# Altium schematic sheet Power.SchDoc: Power
size 762 x 381 mm; DrawnBy: Soumil Jain
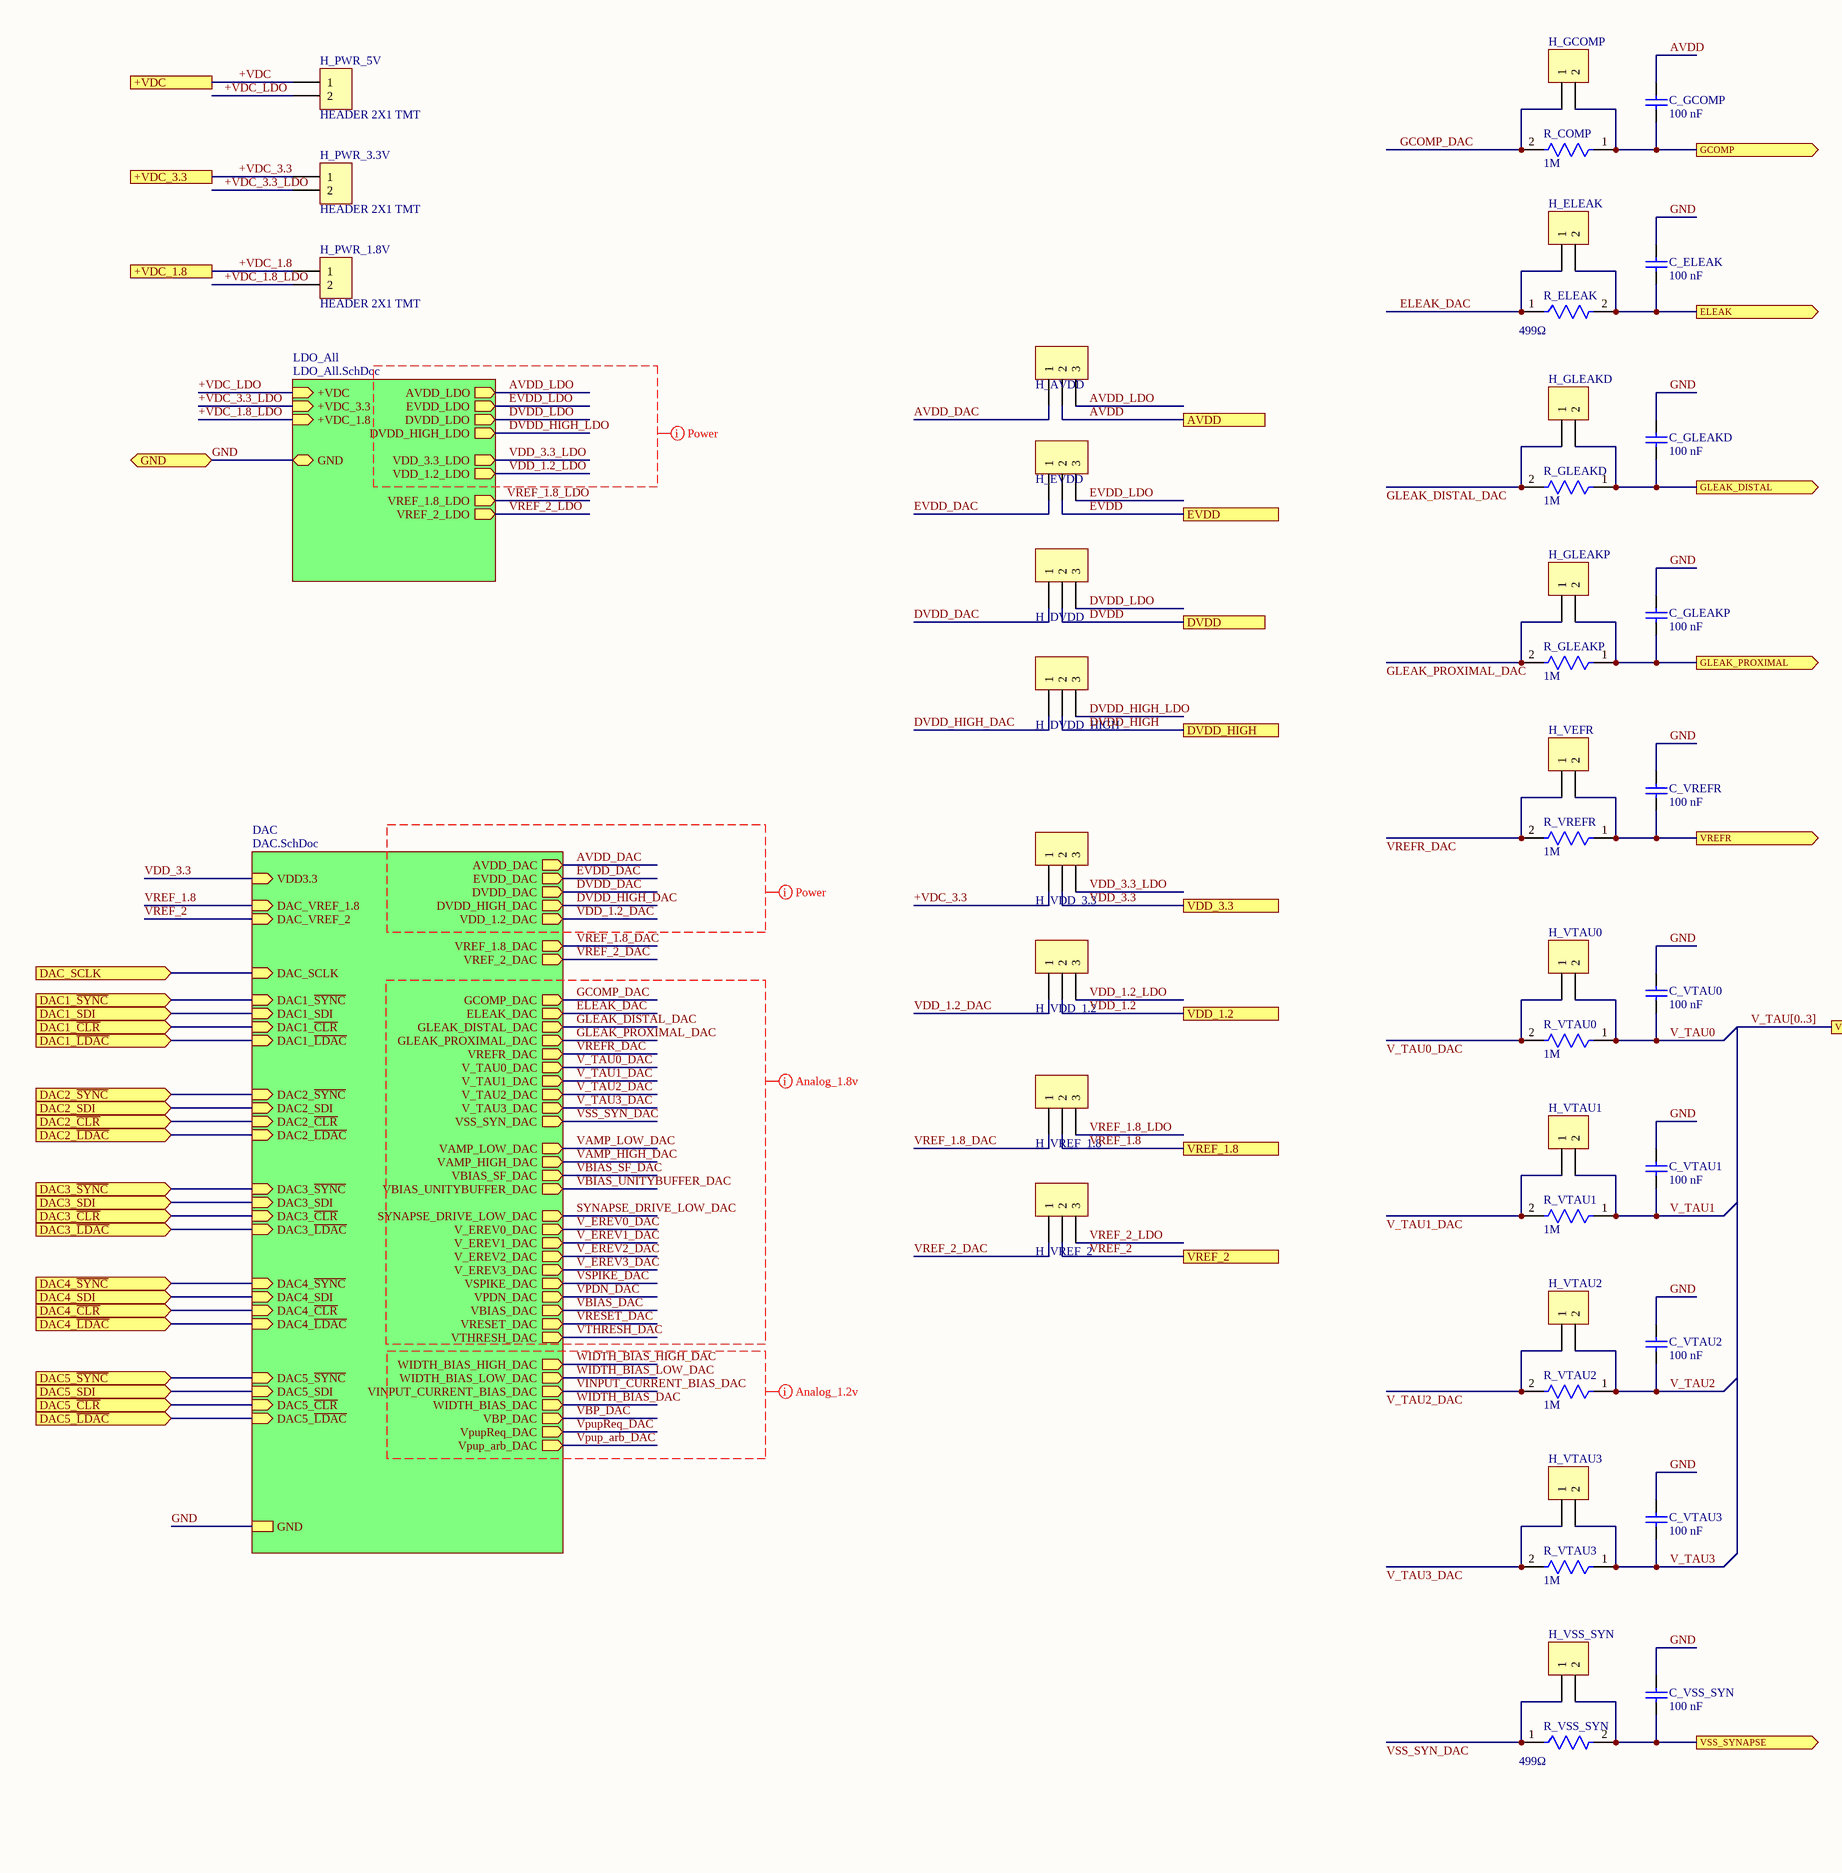
[diagram p0: Power.SchDoc, left]
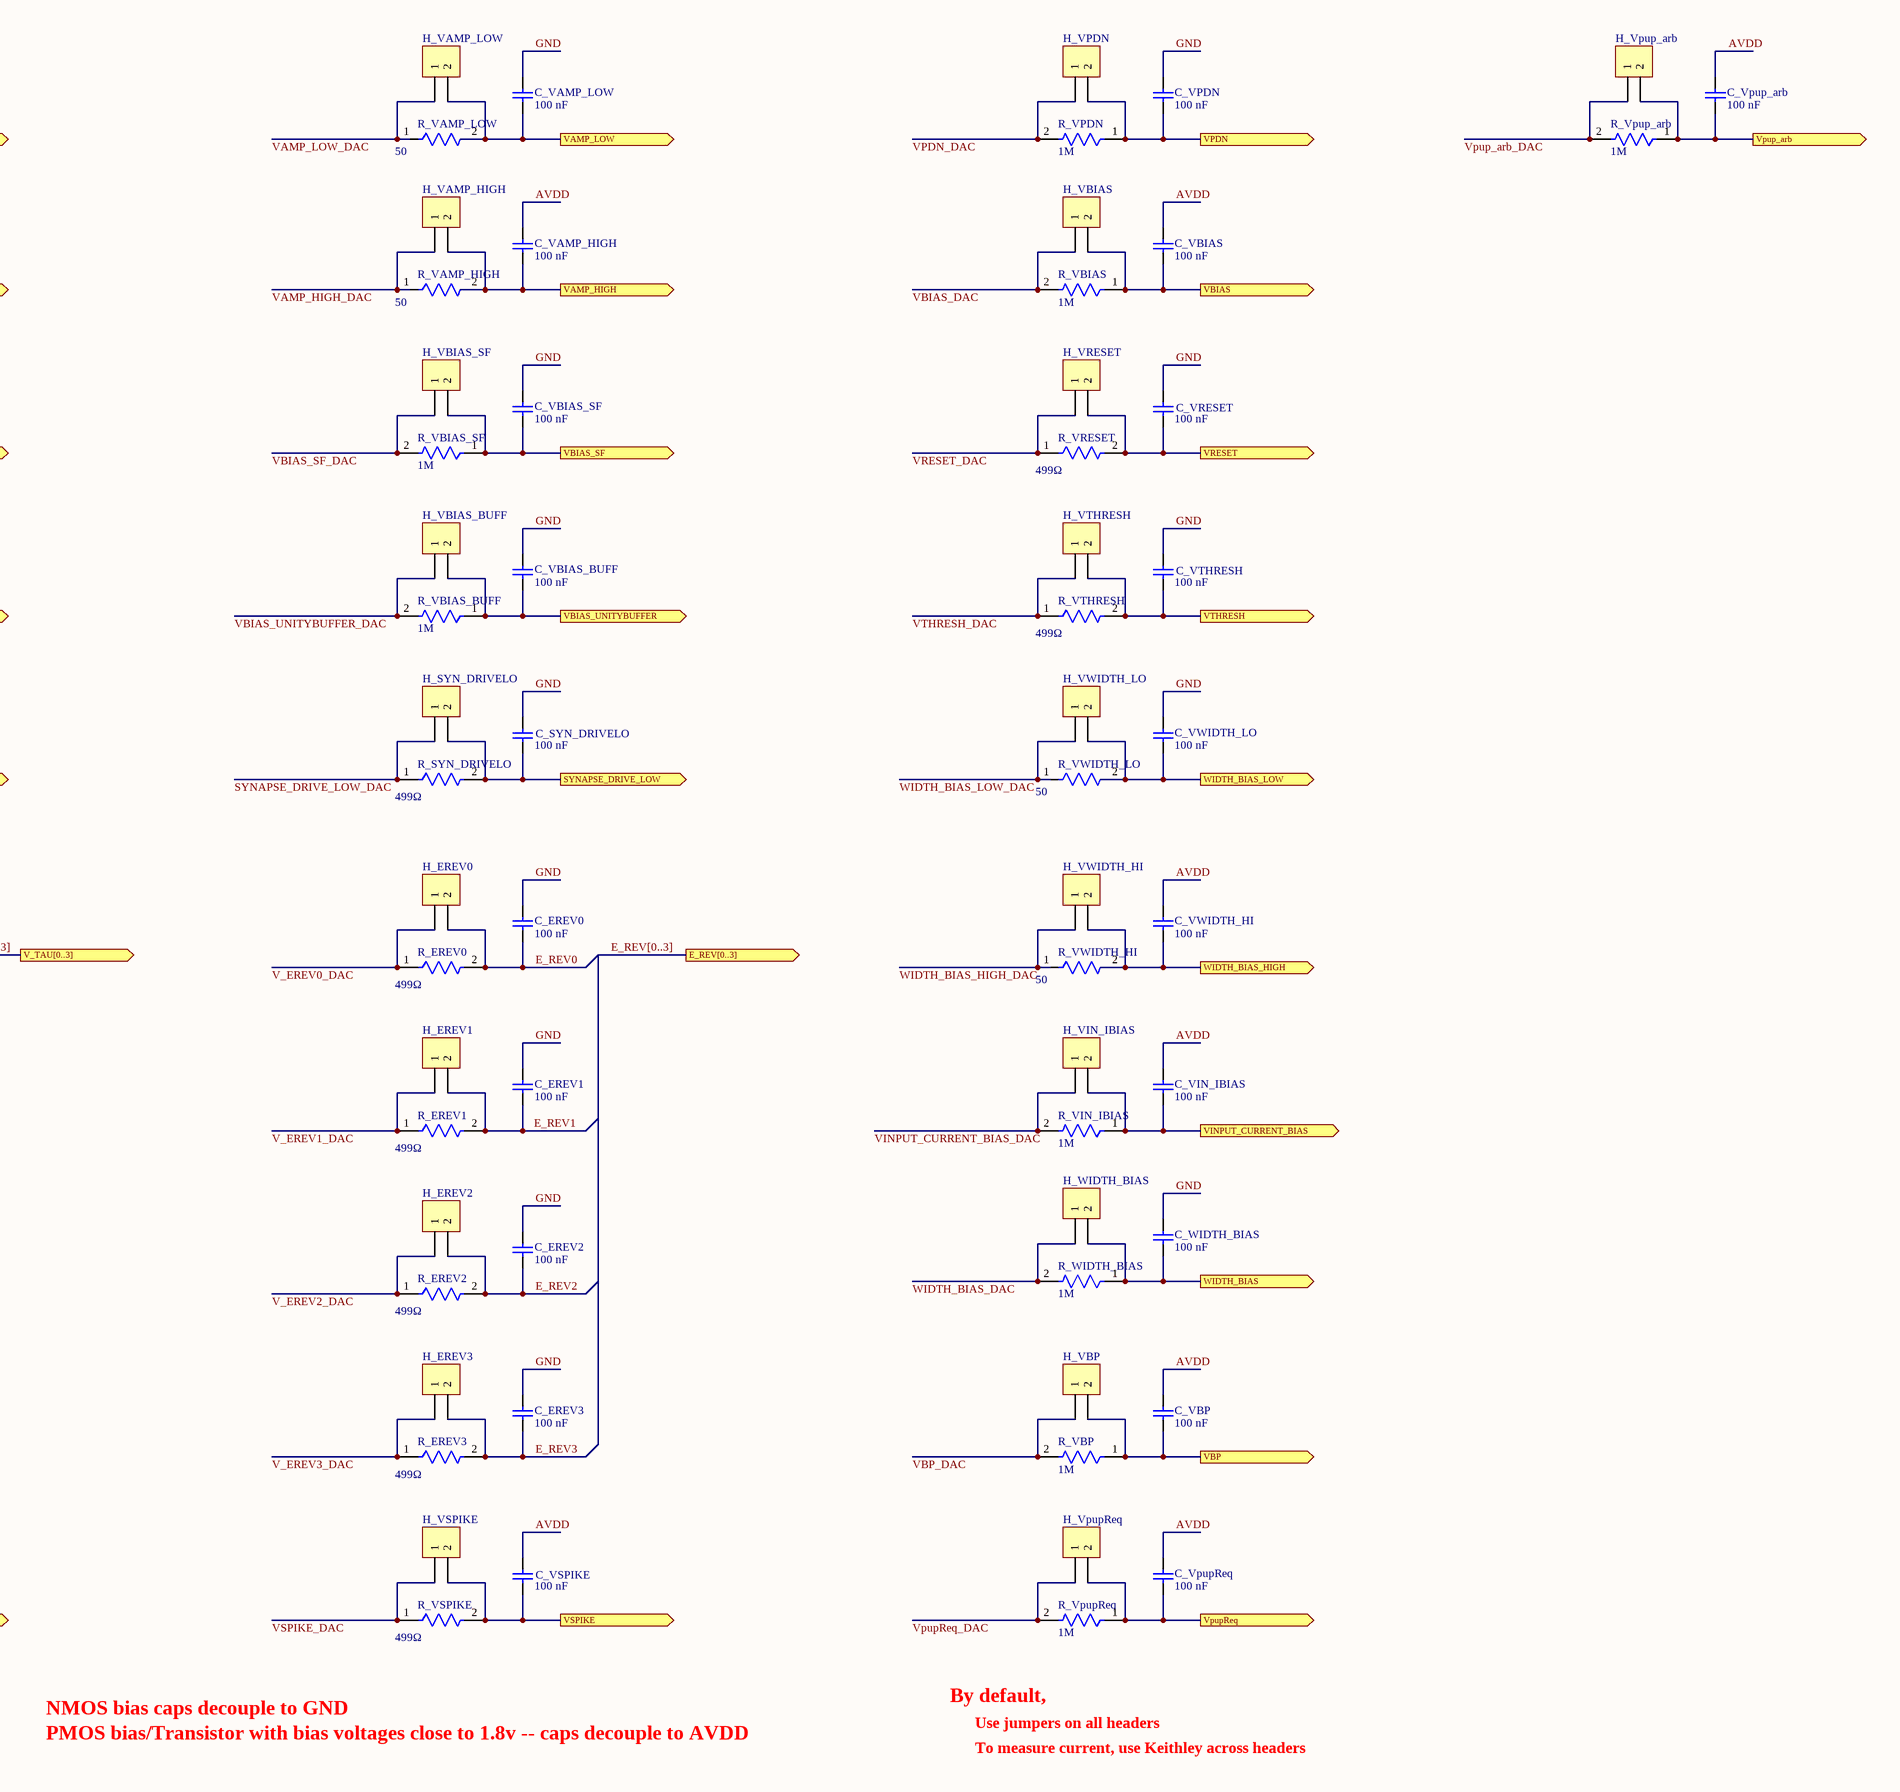
[diagram p1: Power.SchDoc, right]

## Parts
C_ELEAK  value 100 nF  [KEMET C0805C104J8RACTU]  (hidden comment: Cap 100nF 0805)
C_EREV0  value 100 nF  [KEMET C0805C104J8RACTU]  (hidden comment: Cap 100nF 0805)
C_EREV1  value 100 nF  [KEMET C0805C104J8RACTU]  (hidden comment: Cap 100nF 0805)
C_EREV2  value 100 nF  [KEMET C0805C104J8RACTU]  (hidden comment: Cap 100nF 0805)
C_EREV3  value 100 nF  [KEMET C0805C104J8RACTU]  (hidden comment: Cap 100nF 0805)
C_GCOMP  value 100 nF  [KEMET C0805C104J8RACTU]  (hidden comment: Cap 100nF 0805)
C_GLEAKD  value 100 nF  [KEMET C0805C104J8RACTU]  (hidden comment: Cap 100nF 0805)
C_GLEAKP  value 100 nF  [KEMET C0805C104J8RACTU]  (hidden comment: Cap 100nF 0805)
C_SYN_DRIVELO  value 100 nF  [KEMET C0805C104J8RACTU]  (hidden comment: Cap 100nF 0805)
C_VAMP_HIGH  value 100 nF  [KEMET C0805C104J8RACTU]  (hidden comment: Cap 100nF 0805)
C_VAMP_LOW  value 100 nF  [KEMET C0805C104J8RACTU]  (hidden comment: Cap 100nF 0805)
C_VBIAS  value 100 nF  [KEMET C0805C104J8RACTU]  (hidden comment: Cap 100nF 0805)
C_VBIAS_BUFF  value 100 nF  [KEMET C0805C104J8RACTU]  (hidden comment: Cap 100nF 0805)
C_VBIAS_SF  value 100 nF  [KEMET C0805C104J8RACTU]  (hidden comment: Cap 100nF 0805)
C_VBP  value 100 nF  [KEMET C0805C104J8RACTU]  (hidden comment: Cap 100nF 0805)
C_VIN_IBIAS  value 100 nF  [KEMET C0805C104J8RACTU]  (hidden comment: Cap 100nF 0805)
C_VPDN  value 100 nF  [KEMET C0805C104J8RACTU]  (hidden comment: Cap 100nF 0805)
C_Vpup_arb  value 100 nF  [KEMET C0805C104J8RACTU]  (hidden comment: Cap 100nF 0805)
C_VpupReq  value 100 nF  [KEMET C0805C104J8RACTU]  (hidden comment: Cap 100nF 0805)
C_VREFR  value 100 nF  [KEMET C0805C104J8RACTU]  (hidden comment: Cap 100nF 0805)
C_VRESET  value 100 nF  [KEMET C0805C104J8RACTU]  (hidden comment: Cap 100nF 0805)
C_VSPIKE  value 100 nF  [KEMET C0805C104J8RACTU]  (hidden comment: Cap 100nF 0805)
C_VSS_SYN  value 100 nF  [KEMET C0805C104J8RACTU]  (hidden comment: Cap 100nF 0805)
C_VTAU0  value 100 nF  [KEMET C0805C104J8RACTU]  (hidden comment: Cap 100nF 0805)
C_VTAU1  value 100 nF  [KEMET C0805C104J8RACTU]  (hidden comment: Cap 100nF 0805)
C_VTAU2  value 100 nF  [KEMET C0805C104J8RACTU]  (hidden comment: Cap 100nF 0805)
C_VTAU3  value 100 nF  [KEMET C0805C104J8RACTU]  (hidden comment: Cap 100nF 0805)
C_VTHRESH  value 100 nF  [KEMET C0805C104J8RACTU]  (hidden comment: Cap 100nF 0805)
C_VWIDTH_HI  value 100 nF  [KEMET C0805C104J8RACTU]  (hidden comment: Cap 100nF 0805)
C_VWIDTH_LO  value 100 nF  [KEMET C0805C104J8RACTU]  (hidden comment: Cap 100nF 0805)
C_WIDTH_BIAS  value 100 nF  [KEMET C0805C104J8RACTU]  (hidden comment: Cap 100nF 0805)
H_AVDD  HEADER 3X1 TMT  [Samtec TSW-103-07-L-S]  (value not drawn)
H_DVDD  HEADER 3X1 TMT  [Samtec TSW-103-07-L-S]  (value not drawn)
H_DVDD_HIGH  HEADER 3X1 TMT  [Samtec TSW-103-07-L-S]  (value not drawn)
H_ELEAK  HEADER 2X1 TMT  [Samtec TSW-102-07-G-S]  (value not drawn)
H_EREV0  HEADER 2X1 TMT  [Samtec TSW-102-07-G-S]  (value not drawn)
H_EREV1  HEADER 2X1 TMT  [Samtec TSW-102-07-G-S]  (value not drawn)
H_EREV2  HEADER 2X1 TMT  [Samtec TSW-102-07-G-S]  (value not drawn)
H_EREV3  HEADER 2X1 TMT  [Samtec TSW-102-07-G-S]  (value not drawn)
H_EVDD  HEADER 3X1 TMT  [Samtec TSW-103-07-L-S]  (value not drawn)
H_GCOMP  HEADER 2X1 TMT  [Samtec TSW-102-07-G-S]  (value not drawn)
H_GLEAKD  HEADER 2X1 TMT  [Samtec TSW-102-07-G-S]  (value not drawn)
H_GLEAKP  HEADER 2X1 TMT  [Samtec TSW-102-07-G-S]  (value not drawn)
H_PWR_1.8V  HEADER 2X1 TMT  [Samtec TSW-102-07-G-S]
H_PWR_3.3V  HEADER 2X1 TMT  [Samtec TSW-102-07-G-S]
H_PWR_5V  HEADER 2X1 TMT  [Samtec TSW-102-07-G-S]
H_SYN_DRIVELO  HEADER 2X1 TMT  [Samtec TSW-102-07-G-S]  (value not drawn)
H_VAMP_HIGH  HEADER 2X1 TMT  [Samtec TSW-102-07-G-S]  (value not drawn)
H_VAMP_LOW  HEADER 2X1 TMT  [Samtec TSW-102-07-G-S]  (value not drawn)
H_VBIAS  HEADER 2X1 TMT  [Samtec TSW-102-07-G-S]  (value not drawn)
H_VBIAS_BUFF  HEADER 2X1 TMT  [Samtec TSW-102-07-G-S]  (value not drawn)
H_VBIAS_SF  HEADER 2X1 TMT  [Samtec TSW-102-07-G-S]  (value not drawn)
H_VBP  HEADER 2X1 TMT  [Samtec TSW-102-07-G-S]  (value not drawn)
H_VDD_1.2  HEADER 3X1 TMT  [Samtec TSW-103-07-L-S]  (value not drawn)
H_VDD_3.3  HEADER 3X1 TMT  [Samtec TSW-103-07-L-S]  (value not drawn)
H_VEFR  HEADER 2X1 TMT  [Samtec TSW-102-07-G-S]  (value not drawn)
H_VIN_IBIAS  HEADER 2X1 TMT  [Samtec TSW-102-07-G-S]  (value not drawn)
H_VPDN  HEADER 2X1 TMT  [Samtec TSW-102-07-G-S]  (value not drawn)
H_Vpup_arb  HEADER 2X1 TMT  [Samtec TSW-102-07-G-S]  (value not drawn)
H_VpupReq  HEADER 2X1 TMT  [Samtec TSW-102-07-G-S]  (value not drawn)
H_VREF_1.8  HEADER 3X1 TMT  [Samtec TSW-103-07-L-S]  (value not drawn)
H_VREF_2  HEADER 3X1 TMT  [Samtec TSW-103-07-L-S]  (value not drawn)
H_VRESET  HEADER 2X1 TMT  [Samtec TSW-102-07-G-S]  (value not drawn)
H_VSPIKE  HEADER 2X1 TMT  [Samtec TSW-102-07-G-S]  (value not drawn)
H_VSS_SYN  HEADER 2X1 TMT  [Samtec TSW-102-07-G-S]  (value not drawn)
H_VTAU0  HEADER 2X1 TMT  [Samtec TSW-102-07-G-S]  (value not drawn)
H_VTAU1  HEADER 2X1 TMT  [Samtec TSW-102-07-G-S]  (value not drawn)
H_VTAU2  HEADER 2X1 TMT  [Samtec TSW-102-07-G-S]  (value not drawn)
H_VTAU3  HEADER 2X1 TMT  [Samtec TSW-102-07-G-S]  (value not drawn)
H_VTHRESH  HEADER 2X1 TMT  [Samtec TSW-102-07-G-S]  (value not drawn)
H_VWIDTH_HI  HEADER 2X1 TMT  [Samtec TSW-102-07-G-S]  (value not drawn)
H_VWIDTH_LO  HEADER 2X1 TMT  [Samtec TSW-102-07-G-S]  (value not drawn)
H_WIDTH_BIAS  HEADER 2X1 TMT  [Samtec TSW-102-07-G-S]  (value not drawn)
R_COMP  1M  [FP-CRCW0603-e3-MFG]
R_ELEAK  Resistance: 499Ω  [FP-RP73P-1J-MFG]  (hidden comment: RP73PF1J499RBTDF)
R_EREV0  Resistance: 499Ω  [FP-RP73P-1J-MFG]  (hidden comment: RP73PF1J499RBTDF)
R_EREV1  Resistance: 499Ω  [FP-RP73P-1J-MFG]  (hidden comment: RP73PF1J499RBTDF)
R_EREV2  Resistance: 499Ω  [FP-RP73P-1J-MFG]  (hidden comment: RP73PF1J499RBTDF)
R_EREV3  Resistance: 499Ω  [FP-RP73P-1J-MFG]  (hidden comment: RP73PF1J499RBTDF)
R_GLEAKD  1M  [FP-CRCW0603-e3-MFG]
R_GLEAKP  1M  [FP-CRCW0603-e3-MFG]
R_SYN_DRIVELO  Resistance: 499Ω  [FP-RP73P-1J-MFG]  (hidden comment: RP73PF1J499RBTDF)
R_VAMP_HIGH  RESISTANCE: 50  [FP-RN731E-IPC_A]  (hidden comment: RN731ETTP50R0F50)
R_VAMP_LOW  RESISTANCE: 50  [FP-RN731E-IPC_A]  (hidden comment: RN731ETTP50R0F50)
R_VBIAS  1M  [FP-CRCW0603-e3-MFG]
R_VBIAS_BUFF  1M  [FP-CRCW0603-e3-MFG]
R_VBIAS_SF  1M  [FP-CRCW0603-e3-MFG]
R_VBP  1M  [FP-CRCW0603-e3-MFG]
R_VIN_IBIAS  1M  [FP-CRCW0603-e3-MFG]
R_VPDN  1M  [FP-CRCW0603-e3-MFG]
R_Vpup_arb  1M  [FP-CRCW0603-e3-MFG]
R_VpupReq  1M  [FP-CRCW0603-e3-MFG]
R_VREFR  1M  [FP-CRCW0603-e3-MFG]
R_VRESET  Resistance: 499Ω  [FP-RP73P-1J-MFG]  (hidden comment: RP73PF1J499RBTDF)
R_VSPIKE  Resistance: 499Ω  [FP-RP73P-1J-MFG]  (hidden comment: RP73PF1J499RBTDF)
R_VSS_SYN  Resistance: 499Ω  [FP-RP73P-1J-MFG]  (hidden comment: RP73PF1J499RBTDF)
R_VTAU0  1M  [FP-CRCW0603-e3-MFG]
R_VTAU1  1M  [FP-CRCW0603-e3-MFG]
R_VTAU2  1M  [FP-CRCW0603-e3-MFG]
R_VTAU3  1M  [FP-CRCW0603-e3-MFG]
R_VTHRESH  Resistance: 499Ω  [FP-RP73P-1J-MFG]  (hidden comment: RP73PF1J499RBTDF)
R_VWIDTH_HI  RESISTANCE: 50  [FP-RN731E-IPC_A]  (hidden comment: RN731ETTP50R0F50)
R_VWIDTH_LO  RESISTANCE: 50  [FP-RN731E-IPC_A]  (hidden comment: RN731ETTP50R0F50)
R_WIDTH_BIAS  1M  [FP-CRCW0603-e3-MFG]

## Sub-sheets
DAC = DAC.SchDoc: DAC1_~{SYNC} (in), DAC_SCLK (in), DAC1_SDI (in), VDD3.3 (in), DAC_VREF_1.8 (in), EVDD_DAC (out), DAC1_~{CLR} (in), DAC1_~{LDAC} (in), GND, DAC2_~{SYNC} (in), DAC2_SDI (in), DAC2_~{CLR} (in), DAC2_~{LDAC} (in), AVDD_DAC (out), DVDD_DAC (out), DVDD_HIGH_DAC (out), VREF_1.8_DAC (out), GCOMP_DAC (out), ELEAK_DAC (out), GLEAK_DISTAL_DAC (out), GLEAK_PROXIMAL_DAC (out), VREFR_DAC (out), V_TAU0_DAC (out), V_TAU1_DAC (out), V_TAU2_DAC (out), V_TAU3_DAC (out), VSS_SYN_DAC (out), VAMP_LOW_DAC (out), VAMP_HIGH_DAC (out), VBIAS_SF_DAC (out), VBIAS_UNITYBUFFER_DAC (out), SYNAPSE_DRIVE_LOW_DAC (out), V_EREV0_DAC (out), V_EREV2_DAC (out), V_EREV1_DAC (out), V_EREV3_DAC (out), VSPIKE_DAC (out), VPDN_DAC (out), VBIAS_DAC (out), VRESET_DAC (out), VTHRESH_DAC (out), WIDTH_BIAS_HIGH_DAC (out), WIDTH_BIAS_LOW_DAC (out), VINPUT_CURRENT_BIAS_DAC (out), WIDTH_BIAS_DAC (out), VBP_DAC (out), VpupReq_DAC (out), Vpup_arb_DAC (out), DAC3_~{SYNC} (in), DAC3_SDI (in), DAC3_~{CLR} (in), DAC3_~{LDAC} (in), DAC_VREF_2 (in), VREF_2_DAC (out), DAC4_~{SYNC} (in), DAC4_SDI (in), DAC4_~{CLR} (in), DAC4_~{LDAC} (in), DAC5_~{LDAC} (in), DAC5_SDI (in), DAC5_~{SYNC} (in), DAC5_~{CLR} (in), VDD_1.2_DAC (out)
LDO_All = LDO_All.SchDoc: +VDC (in), GND (bidir), AVDD_LDO (out), DVDD_HIGH_LDO (out), EVDD_LDO (out), +VDC_3.3 (in), +VDC_1.8 (in), DVDD_LDO (out), VDD_3.3_LDO (out), VREF_1.8_LDO (out), VREF_2_LDO (out), VDD_1.2_LDO (out)

## Ports
+VDC, +VDC_1.8, +VDC_3.3, AVDD, DAC1_SDI (in), DAC1_~{CLR} (in), DAC1_~{LDAC} (in), DAC1_~{SYNC} (in), DAC2_SDI (in), DAC2_~{CLR} (in), DAC2_~{LDAC} (in), DAC2_~{SYNC} (in), DAC3_SDI (in), DAC3_~{CLR} (in), DAC3_~{LDAC} (in), DAC3_~{SYNC} (in), DAC4_SDI (in), DAC4_~{CLR} (in), DAC4_~{LDAC} (in), DAC4_~{SYNC} (in), DAC5_SDI (in), DAC5_~{CLR} (in), DAC5_~{LDAC} (in), DAC5_~{SYNC} (in), DAC_SCLK (in), DVDD, DVDD_HIGH, E_REV[0..3] (out), ELEAK (out), EVDD, GCOMP (out), GLEAK_DISTAL (out), GLEAK_PROXIMAL (out), GND (bidir), SYNAPSE_DRIVE_LOW (out), V_TAU[0..3] (out), VAMP_HIGH (out), VAMP_LOW (out), VBIAS (out), VBIAS_SF (out), VBIAS_UNITYBUFFER (out), VBP (out), VDD_1.2, VDD_3.3, VINPUT_CURRENT_BIAS (out), VPDN (out), Vpup_arb (out), VpupReq (out), VREF_1.8, VREF_2, VREFR (out), VRESET (out), VSPIKE (out), VSS_SYNAPSE (out), VTHRESH (out), WIDTH_BIAS (out), WIDTH_BIAS_HIGH (out), WIDTH_BIAS_LOW (out)

## Nets
+VDC: H_PWR_5V.1 ; port +VDC
+VDC_1.8: H_PWR_1.8V.1 ; port +VDC_1.8
+VDC_1.8_LDO: H_PWR_1.8V.2 ; sheet LDO_All/+VDC_1.8
+VDC_3.3: H_PWR_3.3V.1 H_VDD_3.3.1 ; port +VDC_3.3
+VDC_3.3_LDO: H_PWR_3.3V.2 ; sheet LDO_All/+VDC_3.3
+VDC_LDO: H_PWR_5V.2 ; sheet LDO_All/+VDC
AVDD: C_GCOMP.1 C_VAMP_HIGH.1 C_VBIAS.1 C_VBP.1 C_VIN_IBIAS.1 C_Vpup_arb.1 C_VpupReq.1 C_VSPIKE.1 C_VWIDTH_HI.1 H_AVDD.2 ; port AVDD
AVDD_DAC: H_AVDD.1 ; sheet DAC/AVDD_DAC
AVDD_LDO: H_AVDD.3 ; sheet LDO_All/AVDD_LDO
DAC1_~{CLR}: port DAC1_~{CLR}, sheet DAC/DAC1_~{CLR}
DAC1_~{LDAC}: port DAC1_~{LDAC}, sheet DAC/DAC1_~{LDAC}
DAC1_~{SYNC}: port DAC1_~{SYNC}, sheet DAC/DAC1_~{SYNC}
DAC1_SDI: port DAC1_SDI, sheet DAC/DAC1_SDI
DAC2_~{CLR}: port DAC2_~{CLR}, sheet DAC/DAC2_~{CLR}
DAC2_~{LDAC}: port DAC2_~{LDAC}, sheet DAC/DAC2_~{LDAC}
DAC2_~{SYNC}: port DAC2_~{SYNC}, sheet DAC/DAC2_~{SYNC}
DAC2_SDI: port DAC2_SDI, sheet DAC/DAC2_SDI
DAC3_~{CLR}: port DAC3_~{CLR}, sheet DAC/DAC3_~{CLR}
DAC3_~{LDAC}: port DAC3_~{LDAC}, sheet DAC/DAC3_~{LDAC}
DAC3_~{SYNC}: port DAC3_~{SYNC}, sheet DAC/DAC3_~{SYNC}
DAC3_SDI: port DAC3_SDI, sheet DAC/DAC3_SDI
DAC4_~{CLR}: port DAC4_~{CLR}, sheet DAC/DAC4_~{CLR}
DAC4_~{LDAC}: port DAC4_~{LDAC}, sheet DAC/DAC4_~{LDAC}
DAC4_~{SYNC}: port DAC4_~{SYNC}, sheet DAC/DAC4_~{SYNC}
DAC4_SDI: port DAC4_SDI, sheet DAC/DAC4_SDI
DAC5_~{CLR}: port DAC5_~{CLR}, sheet DAC/DAC5_~{CLR}
DAC5_~{LDAC}: port DAC5_~{LDAC}, sheet DAC/DAC5_~{LDAC}
DAC5_~{SYNC}: port DAC5_~{SYNC}, sheet DAC/DAC5_~{SYNC}
DAC5_SDI: port DAC5_SDI, sheet DAC/DAC5_SDI
DAC_SCLK: port DAC_SCLK, sheet DAC/DAC_SCLK
DVDD: H_DVDD.2 ; port DVDD
DVDD_DAC: H_DVDD.1 ; sheet DAC/DVDD_DAC
DVDD_HIGH: H_DVDD_HIGH.2 ; port DVDD_HIGH
DVDD_HIGH_DAC: H_DVDD_HIGH.1 ; sheet DAC/DVDD_HIGH_DAC
DVDD_HIGH_LDO: H_DVDD_HIGH.3 ; sheet LDO_All/DVDD_HIGH_LDO
DVDD_LDO: H_DVDD.3 ; sheet LDO_All/DVDD_LDO
E_REV0: C_EREV0.2 H_EREV0.2 R_EREV0.2
E_REV1: C_EREV1.2 H_EREV1.2 R_EREV1.2
E_REV2: C_EREV2.2 H_EREV2.2 R_EREV2.2
E_REV3: C_EREV3.2 H_EREV3.2 R_EREV3.2
ELEAK: C_ELEAK.2 H_ELEAK.2 R_ELEAK.2 ; port ELEAK
ELEAK_DAC: H_ELEAK.1 R_ELEAK.1 ; sheet DAC/ELEAK_DAC
EVDD: H_EVDD.2 ; port EVDD
EVDD_DAC: H_EVDD.1 ; sheet DAC/EVDD_DAC
EVDD_LDO: H_EVDD.3 ; sheet LDO_All/EVDD_LDO
GCOMP: C_GCOMP.2 H_GCOMP.2 R_COMP.1 ; port GCOMP
GCOMP_DAC: H_GCOMP.1 R_COMP.2 ; sheet DAC/GCOMP_DAC
GLEAK_DISTAL: C_GLEAKD.2 H_GLEAKD.2 R_GLEAKD.1 ; port GLEAK_DISTAL
GLEAK_DISTAL_DAC: H_GLEAKD.1 R_GLEAKD.2 ; sheet DAC/GLEAK_DISTAL_DAC
GLEAK_PROXIMAL: C_GLEAKP.2 H_GLEAKP.2 R_GLEAKP.1 ; port GLEAK_PROXIMAL
GLEAK_PROXIMAL_DAC: H_GLEAKP.1 R_GLEAKP.2 ; sheet DAC/GLEAK_PROXIMAL_DAC
GND: C_ELEAK.1 C_EREV0.1 C_EREV1.1 C_EREV2.1 C_EREV3.1 C_GLEAKD.1 C_GLEAKP.1 C_SYN_DRIVELO.1 C_VAMP_LOW.1 C_VBIAS_BUFF.1 C_VBIAS_SF.1 C_VPDN.1 C_VREFR.1 C_VRESET.1 C_VSS_SYN.1 C_VTAU0.1 C_VTAU1.1 C_VTAU2.1 C_VTAU3.1 C_VTHRESH.1 C_VWIDTH_LO.1 C_WIDTH_BIAS.1 ; port GND, sheet LDO_All/GND, sheet DAC/GND
SYNAPSE_DRIVE_LOW: C_SYN_DRIVELO.2 H_SYN_DRIVELO.2 R_SYN_DRIVELO.2 ; port SYNAPSE_DRIVE_LOW
SYNAPSE_DRIVE_LOW_DAC: H_SYN_DRIVELO.1 R_SYN_DRIVELO.1 ; sheet DAC/SYNAPSE_DRIVE_LOW_DAC
V_EREV0_DAC: H_EREV0.1 R_EREV0.1 ; sheet DAC/V_EREV0_DAC
V_EREV1_DAC: H_EREV1.1 R_EREV1.1 ; sheet DAC/V_EREV1_DAC
V_EREV2_DAC: H_EREV2.1 R_EREV2.1 ; sheet DAC/V_EREV2_DAC
V_EREV3_DAC: H_EREV3.1 R_EREV3.1 ; sheet DAC/V_EREV3_DAC
V_TAU0: C_VTAU0.2 H_VTAU0.2 R_VTAU0.1
V_TAU0_DAC: H_VTAU0.1 R_VTAU0.2 ; sheet DAC/V_TAU0_DAC
V_TAU1: C_VTAU1.2 H_VTAU1.2 R_VTAU1.1
V_TAU1_DAC: H_VTAU1.1 R_VTAU1.2 ; sheet DAC/V_TAU1_DAC
V_TAU2: C_VTAU2.2 H_VTAU2.2 R_VTAU2.1
V_TAU2_DAC: H_VTAU2.1 R_VTAU2.2 ; sheet DAC/V_TAU2_DAC
V_TAU3: C_VTAU3.2 H_VTAU3.2 R_VTAU3.1
V_TAU3_DAC: H_VTAU3.1 R_VTAU3.2 ; sheet DAC/V_TAU3_DAC
VAMP_HIGH: C_VAMP_HIGH.2 H_VAMP_HIGH.2 R_VAMP_HIGH.2 ; port VAMP_HIGH
VAMP_HIGH_DAC: H_VAMP_HIGH.1 R_VAMP_HIGH.1 ; sheet DAC/VAMP_HIGH_DAC
VAMP_LOW: C_VAMP_LOW.2 H_VAMP_LOW.2 R_VAMP_LOW.2 ; port VAMP_LOW
VAMP_LOW_DAC: H_VAMP_LOW.1 R_VAMP_LOW.1 ; sheet DAC/VAMP_LOW_DAC
VBIAS: C_VBIAS.2 H_VBIAS.2 R_VBIAS.1 ; port VBIAS
VBIAS_DAC: H_VBIAS.1 R_VBIAS.2 ; sheet DAC/VBIAS_DAC
VBIAS_SF: C_VBIAS_SF.2 H_VBIAS_SF.2 R_VBIAS_SF.1 ; port VBIAS_SF
VBIAS_SF_DAC: H_VBIAS_SF.1 R_VBIAS_SF.2 ; sheet DAC/VBIAS_SF_DAC
VBIAS_UNITYBUFFER: C_VBIAS_BUFF.2 H_VBIAS_BUFF.2 R_VBIAS_BUFF.1 ; port VBIAS_UNITYBUFFER
VBIAS_UNITYBUFFER_DAC: H_VBIAS_BUFF.1 R_VBIAS_BUFF.2 ; sheet DAC/VBIAS_UNITYBUFFER_DAC
VBP: C_VBP.2 H_VBP.2 R_VBP.1 ; port VBP
VBP_DAC: H_VBP.1 R_VBP.2 ; sheet DAC/VBP_DAC
VDD_1.2: H_VDD_1.2.2 ; port VDD_1.2
VDD_1.2_DAC: H_VDD_1.2.1 ; sheet DAC/VDD_1.2_DAC
VDD_1.2_LDO: H_VDD_1.2.3 ; sheet LDO_All/VDD_1.2_LDO
VDD_3.3: H_VDD_3.3.2 ; port VDD_3.3, sheet DAC/VDD3.3
VDD_3.3_LDO: H_VDD_3.3.3 ; sheet LDO_All/VDD_3.3_LDO
VINPUT_CURRENT_BIAS: C_VIN_IBIAS.2 H_VIN_IBIAS.2 R_VIN_IBIAS.1 ; port VINPUT_CURRENT_BIAS
VINPUT_CURRENT_BIAS_DAC: H_VIN_IBIAS.1 R_VIN_IBIAS.2 ; sheet DAC/VINPUT_CURRENT_BIAS_DAC
VPDN: C_VPDN.2 H_VPDN.2 R_VPDN.1 ; port VPDN
VPDN_DAC: H_VPDN.1 R_VPDN.2 ; sheet DAC/VPDN_DAC
Vpup_arb: C_Vpup_arb.2 H_Vpup_arb.2 R_Vpup_arb.1 ; port Vpup_arb
Vpup_arb_DAC: H_Vpup_arb.1 R_Vpup_arb.2 ; sheet DAC/Vpup_arb_DAC
VpupReq: C_VpupReq.2 H_VpupReq.2 R_VpupReq.1 ; port VpupReq
VpupReq_DAC: H_VpupReq.1 R_VpupReq.2 ; sheet DAC/VpupReq_DAC
VREF_1.8: H_VREF_1.8.2 ; port VREF_1.8, sheet DAC/DAC_VREF_1.8
VREF_1.8_DAC: H_VREF_1.8.1 ; sheet DAC/VREF_1.8_DAC
VREF_1.8_LDO: H_VREF_1.8.3 ; sheet LDO_All/VREF_1.8_LDO
VREF_2: H_VREF_2.2 ; port VREF_2, sheet DAC/DAC_VREF_2
VREF_2_DAC: H_VREF_2.1 ; sheet DAC/VREF_2_DAC
VREF_2_LDO: H_VREF_2.3 ; sheet LDO_All/VREF_2_LDO
VREFR: C_VREFR.2 H_VEFR.2 R_VREFR.1 ; port VREFR
VREFR_DAC: H_VEFR.1 R_VREFR.2 ; sheet DAC/VREFR_DAC
VRESET: C_VRESET.2 H_VRESET.2 R_VRESET.2 ; port VRESET
VRESET_DAC: H_VRESET.1 R_VRESET.1 ; sheet DAC/VRESET_DAC
VSPIKE: C_VSPIKE.2 H_VSPIKE.2 R_VSPIKE.2 ; port VSPIKE
VSPIKE_DAC: H_VSPIKE.1 R_VSPIKE.1 ; sheet DAC/VSPIKE_DAC
VSS_SYN_DAC: H_VSS_SYN.1 R_VSS_SYN.1 ; sheet DAC/VSS_SYN_DAC
VSS_SYNAPSE: C_VSS_SYN.2 H_VSS_SYN.2 R_VSS_SYN.2 ; port VSS_SYNAPSE
VTHRESH: C_VTHRESH.2 H_VTHRESH.2 R_VTHRESH.2 ; port VTHRESH
VTHRESH_DAC: H_VTHRESH.1 R_VTHRESH.1 ; sheet DAC/VTHRESH_DAC
WIDTH_BIAS: C_WIDTH_BIAS.2 H_WIDTH_BIAS.2 R_WIDTH_BIAS.1 ; port WIDTH_BIAS
WIDTH_BIAS_DAC: H_WIDTH_BIAS.1 R_WIDTH_BIAS.2 ; sheet DAC/WIDTH_BIAS_DAC
WIDTH_BIAS_HIGH: C_VWIDTH_HI.2 H_VWIDTH_HI.2 R_VWIDTH_HI.2 ; port WIDTH_BIAS_HIGH
WIDTH_BIAS_HIGH_DAC: H_VWIDTH_HI.1 R_VWIDTH_HI.1 ; sheet DAC/WIDTH_BIAS_HIGH_DAC
WIDTH_BIAS_LOW: C_VWIDTH_LO.2 H_VWIDTH_LO.2 R_VWIDTH_LO.2 ; port WIDTH_BIAS_LOW
WIDTH_BIAS_LOW_DAC: H_VWIDTH_LO.1 R_VWIDTH_LO.1 ; sheet DAC/WIDTH_BIAS_LOW_DAC

## Buses and harness runs
bus E_REV[0..3] = port E_REV[0..3]
bus V_TAU[0..3] = port V_TAU[0..3]

## Layout directives
mark named Power: AVDD_DAC, AVDD_LDO, DVDD_DAC, DVDD_HIGH_DAC, DVDD_HIGH_LDO, DVDD_LDO, EVDD_DAC, EVDD_LDO, VDD_1.2_DAC, VDD_1.2_LDO, VDD_3.3_LDO
mark named Analog_1.8v: ELEAK_DAC, GCOMP_DAC, GLEAK_DISTAL_DAC, GLEAK_PROXIMAL_DAC, SYNAPSE_DRIVE_LOW_DAC, V_EREV0_DAC, V_EREV1_DAC, V_EREV2_DAC, V_EREV3_DAC, V_TAU0_DAC, V_TAU1_DAC, V_TAU2_DAC, V_TAU3_DAC, VAMP_HIGH_DAC, VAMP_LOW_DAC, VBIAS_DAC, VBIAS_SF_DAC, VBIAS_UNITYBUFFER_DAC, VPDN_DAC, VREFR_DAC, VRESET_DAC, VSPIKE_DAC, VSS_SYN_DAC, VTHRESH_DAC
mark named Analog_1.2v: VBP_DAC, VINPUT_CURRENT_BIAS_DAC, Vpup_arb_DAC, VpupReq_DAC, WIDTH_BIAS_DAC, WIDTH_BIAS_HIGH_DAC, WIDTH_BIAS_LOW_DAC

## Notes on the sheet
- NMOS bias caps decouple to GND
- PMOS bias/Transistor with bias voltages close to 1.8v -- caps decouple to AVDD
- By default,
- Use jumpers on all headers
- To measure current, use Keithley across headers

## Library data of the parts
C_ELEAK C_EREV0-C_EREV3 C_GCOMP C_GLEAKD C_GLEAKP C_SYN_DRIVELO C_VAMP_HIGH C_VAMP_LOW C_VBIAS C_VBIAS_BUFF C_VBIAS_SF C_VBP C_VIN_IBIAS C_VPDN C_Vpup_arb C_VpupReq C_VREFR C_VRESET C_VSPIKE C_VSS_SYN C_VTAU0-C_VTAU3 C_VTHRESH C_VWIDTH_HI C_VWIDTH_LO C_WIDTH_BIAS = Cap 100nF 0805: CAP CER 0.1UF 10V X7R 0805 / ±10% 10V Ceramic Capacitor X7R 0805 (2012 Metric); Supplier 1: Digi-Key; Supplier Part Number 1: 478-5311-1-ND
H_AVDD H_DVDD H_DVDD_HIGH H_EVDD H_VDD_1.2 H_VDD_3.3 H_VREF_1.8 H_VREF_2 = HEADER 3X1 TMT: CONN HEADER VERT 3POS 2.54MM / Connector Header Through Hole 3 position 0.100" (2.54mm); Supplier 1: Digi-Key; Supplier Part Number 1: SAM1031-03-ND
H_ELEAK H_EREV0-H_EREV3 H_GCOMP H_GLEAKD H_GLEAKP H_PWR_1.8V H_PWR_3.3V H_PWR_5V H_SYN_DRIVELO H_VAMP_HIGH H_VAMP_LOW H_VBIAS H_VBIAS_BUFF H_VBIAS_SF H_VBP H_VEFR H_VIN_IBIAS H_VPDN H_Vpup_arb H_VpupReq H_VRESET H_VSPIKE H_VSS_SYN H_VTAU0-H_VTAU3 H_VTHRESH H_VWIDTH_HI H_VWIDTH_LO H_WIDTH_BIAS = HEADER 2X1 TMT: CONN HEADER VERT 2POS 2.54MM / Connector Header Through Hole 2 position 0.100" (2.54mm); Supplier 1: Digi-Key; Supplier Part Number 1: SAM1029-02-ND
R_COMP R_GLEAKD R_GLEAKP R_VBIAS R_VBIAS_BUFF R_VBIAS_SF R_VBP R_VIN_IBIAS R_VPDN R_Vpup_arb R_VpupReq R_VREFR R_VTAU0-R_VTAU3 R_WIDTH_BIAS = CMP-2000-03013-2: RES Thick Film, 1MΩ, 1%, 0.1W, 100ppm/°C, 0603; Max Power Dissipation: 100mW; Resistance: 1MR; Voltage Rating (DC): 75V; Depth: 0.85mm; Max Operating Temperature: 155°C; Length: 1.55mm; Power Rating: 100mW; Military Standard: Not; Features: Automotive AEC-Q200; Min Operating Temperature: -55°C; Number of Pins: 2; Mount: Surface Mount; Package Quantity: 10; Packaging: Tape and Reel; Height: 0.45mm; Radiation Hardening: No; Case Code (Metric): 1608; Temperature Coefficient: 100ppm/°C; Width: 0.85mm; Composition: Thick Film; Termination: SMD/SMT; Tolerance: 1%; Number of Terminations: 2; Lead Free: Lead Free; Contact Plating: Tin; Case/Package: 0603; Weight: 7.1E-05oz; Voltage Rating: 75V; Case Code (Imperial): 0603
R_ELEAK R_EREV0-R_EREV3 R_SYN_DRIVELO R_VRESET R_VSPIKE R_VSS_SYN R_VTHRESH = CMP-03211-011223-1: RES SMD 499 OHM 0.1% 1/6W 0603; Manufacturer: TE Connectivity; Tolerance: 0.001; Description: RP73P 0603 499Ω 0.166W 25ppm/°C 0.10% 100V; Voltage Rating: 100V; Value: 499Ω; Power Rating: 0.166W; Temperature Coefficient: 25ppm/°C; Device Class L3: Chip SMD Resistors; Device Class L2: Resistors; Temperature Range High: +155°C; Octopart: https://octopart.com/rp73pf1j499rbtdf-te+connectivity-45466091; Height: 0.55mm; Series: RP73P; RoHS: TRUE; Category: Res; Lead Free: Yes; Temperature: -55°C to +155°C; Digikey Description: RES SMD 499 OHM 0.1% 1/6W 0603; Temperature Range Low: -55°C; Mouser Description: Thin Film Resistors - SMD RP 1J 0.166W 499R 0.1% 25PPM 1K RL; ComponentLink2Description: Datasheet; Automotive: No; Package: RP73P-1J; Manufacturer Part Number: RP73PF1J499RBTDF; ComponentLink2URL: https://www.te.com/commerce/DocumentDelivery/DDEController?Action=srchrtrv&DocNm=1773272&DocType=DS&DocLang=English; Device Class L1: Passive Components; Composition: Thin Film; Ipc Land Pattern Name: RESC15580X45
R_VAMP_HIGH R_VAMP_LOW R_VWIDTH_HI R_VWIDTH_LO = CMP-04015-013028-1: 50Ω ±1% 0.063W, 1/16W Chip Resistor 0402 (1005 Metric) Moisture Resistant Thin Film